# EAGLE schematic Power_Meter_v1.0 (EAGLE 9.1.0)
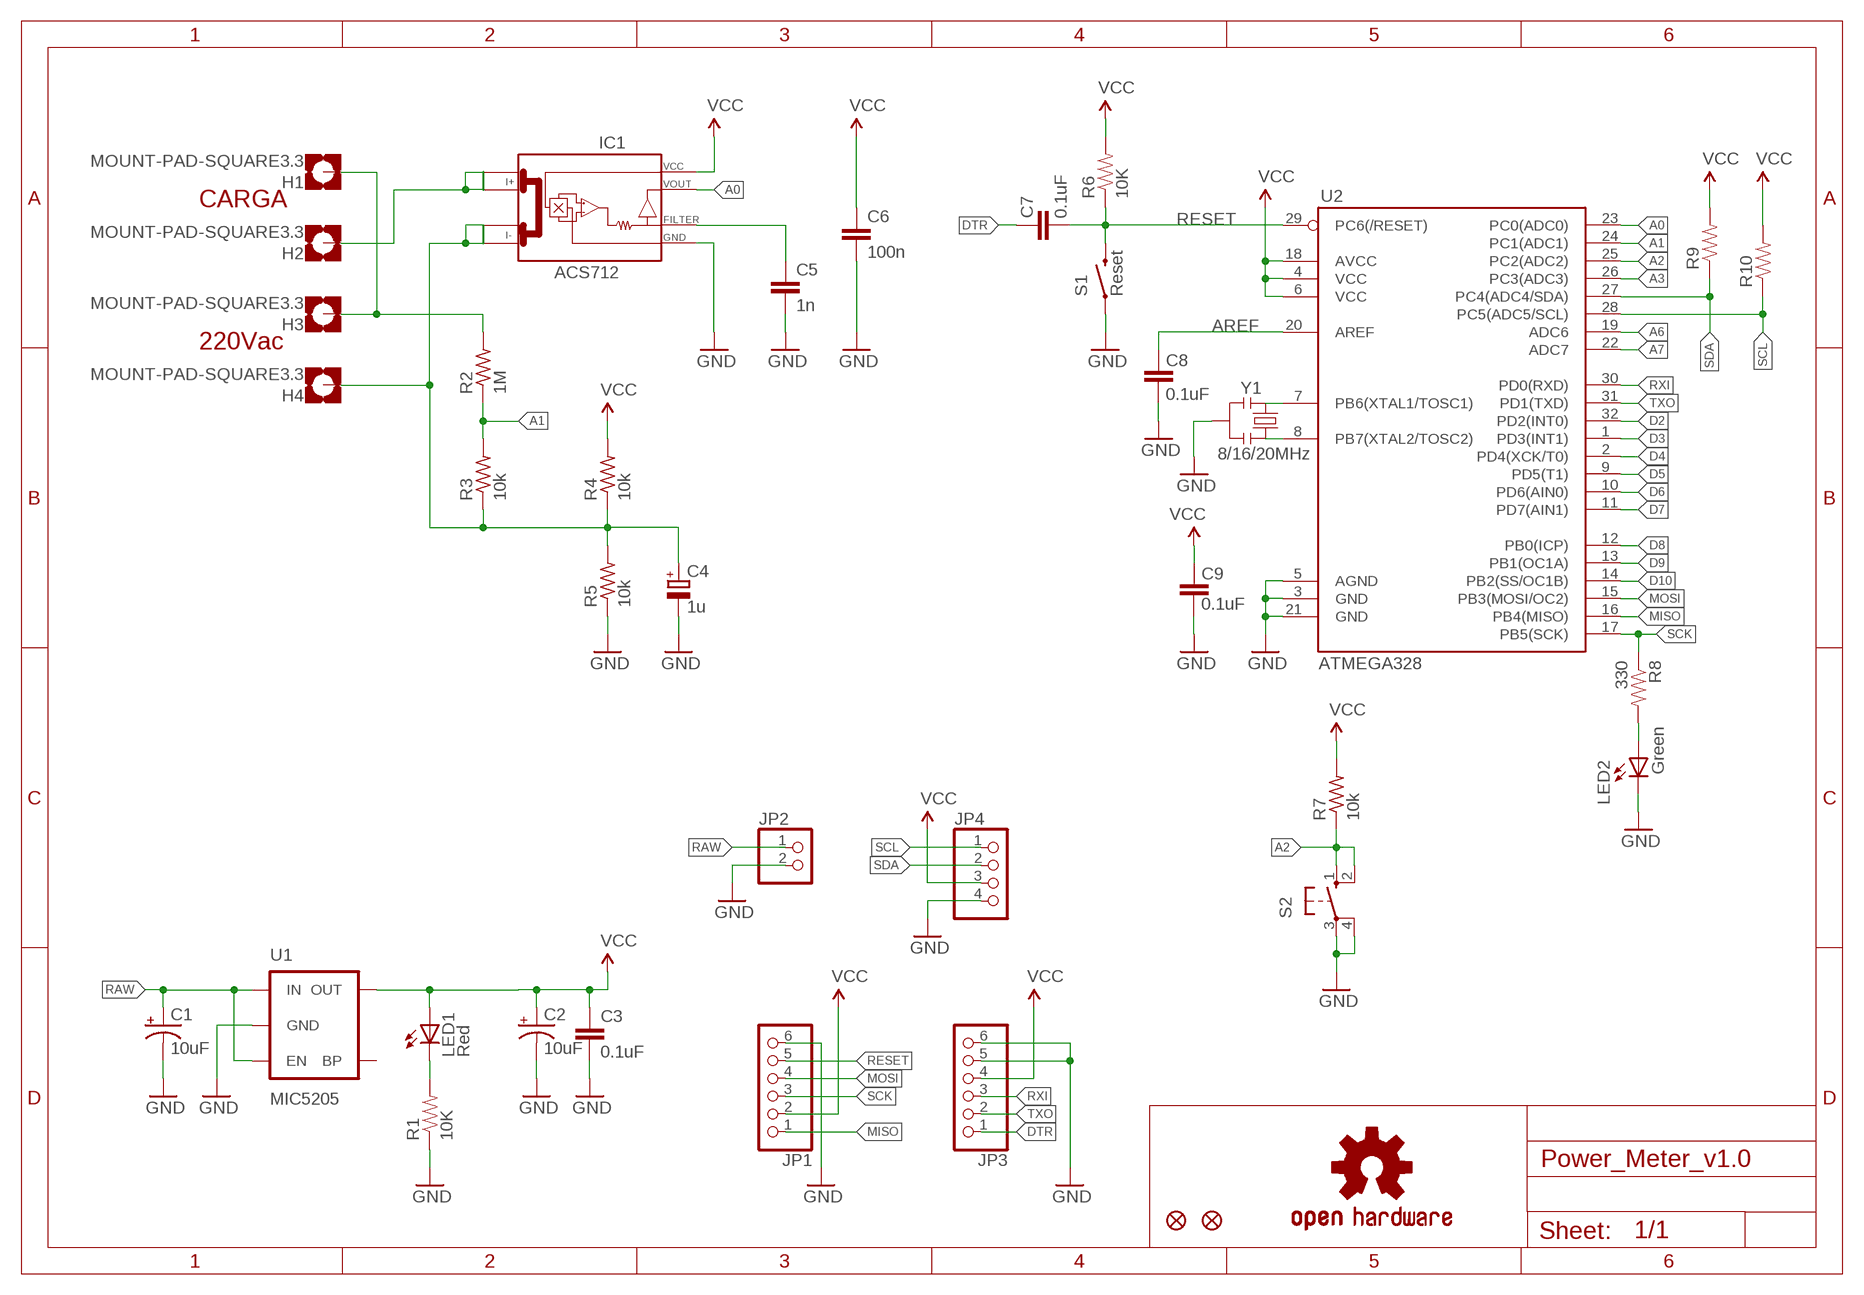
[diagram p0: schematic, sheet 1]

## Parts
C1  10uF  CAP_POL1206  [EIA3216]
C2  10uF  CAP_POL1206  [EIA3216]
C3  0.1uF  CAP0603-CAP  [0603-CAP]
C4  1u  CPOL-EUE2-5  [E2-5]
C5  1n  C-EUC0805K  [C0805K]
C6  100n  C-EUC0805K  [C0805K]
C7  0.1uF  CAP0603-CAP  [0603-CAP]
C8  0.1uF  CAP0603-CAP  [0603-CAP]
C9  0.1uF  CAP0603-CAP  [0603-CAP]
H1  MOUNT-PAD-SQUARE3.3  [3,3-PAD-SQUARE]
H2  MOUNT-PAD-SQUARE3.3  [3,3-PAD-SQUARE]
H3  MOUNT-PAD-SQUARE3.3  [3,3-PAD-SQUARE]
H4  MOUNT-PAD-SQUARE3.3  [3,3-PAD-SQUARE]
IC1  ACS712  [SO08]
JP1  PINHD-1X6  [1X06]
JP2  PINHD-1X2  [1X02]
JP3  PINHD-1X6  [1X06]
JP4  PINHD-1X4  [1X04]
JP5  FIDUCIAL1X2.5  [FIDUCIAL-1X2.5]
JP6  FIDUCIAL1X2.5  [FIDUCIAL-1X2.5]
LED1  Red  LED  [0603-LED-ALT1]
LED2  Green  LED  [0603-LED-ALT1]
R1  10K  RESISTOR0603-RES  [0603-RES]
R2  1M  R-US_0204/7  [0204/7]
R3  10k  R-US_0204/7  [0204/7]
R4  10k  R-US_0204/7  [0204/7]
R5  10k  R-US_0204/7  [0204/7]
R6  10K  RESISTOR0603-RES  [0603-RES]
R7  10k  R-US_0204/7  [0204/7]
R8  330  RESISTOR0603-RES  [0603-RES]
R9  RESISTOR0603-RES  [0603-RES]
R10  RESISTOR0603-RES  [0603-RES]
S1  Reset  SWITCH-MOMENTARY-2SMD-ALT01  [TACTILE-SWITCH-SMD-ALT01]
S2  10-XX  [B3F-10XX]
U1  MIC5205  V_REG_LDOSMD  [SOT23-5]
U2  ATMEGA328  ATMEGA168  [TQFP32-08]
U$5  OSHW-LOGOS  [OSHW-LOGO-S]
Y1  8/16/20MHz  RESONATOR1:1  [RESONATOR-SMD-1:1]

## Nets
A0: IC1.7(VOUT) U2.23(PC0(ADC0))
A1: R2.1 R3.2 U2.24(PC1(ADC1))
A2: R7.1 S2.1(S) S2.2(S1) U2.25(PC2(ADC2))
A3: U2.26(PC3(ADC3))
A6: U2.19(ADC6)
A7: U2.22(ADC7)
AREF: C8.2 U2.20(AREF)
D2: U2.32(PD2(INT0))
D3: U2.1(PD3(INT1))
D4: U2.2(PD4(XCK/T0))
D5: U2.9(PD5(T1))
D6: U2.10(PD6(AIN0))
D7: U2.11(PD7(AIN1))
D8: U2.12(PB0(ICP))
D9: U2.13(PB1(OC1A))
D10: U2.14(PB2(SS/OC1B))
DTR: C7.2 JP3.1
GND: C1.C(-) C2.C(-) C3.2 C4.- C5.2 C6.2 C8.1 C9.1 IC1.5(GND) JP1.6 JP2.2 JP3.5 JP3.6 JP4.4 LED2.C R1.1 R5.1 S1.1 S1.2 S2.3(P) S2.4(P1) U1.2(GND) U2.3(GND) U2.5(AGND) U2.21(GND) Y1.2
MISO: JP1.1 U2.16(PB4(MISO))
MOSI: JP1.4 U2.15(PB3(MOSI/OC2))
N$1: LED2.A R8.2
N$2: U2.8(PB7(XTAL2/TOSC2)) Y1.3
N$3: U2.7(PB6(XTAL1/TOSC1)) Y1.1
N$6: H1.B3,3(MOUNT) H3.B3,3(MOUNT) R2.2
N$7: C5.1 IC1.6(FILTER)
N$8: H2.B3,3(MOUNT) IC1.1(I+_0) IC1.2(I+_1)
N$9: LED1.C R1.2
N$10: C4.+ H4.B3,3(MOUNT) IC1.3(I-_0) IC1.4(I-_1) R3.1 R4.1 R5.2
RAW [vcc]: C1.A(+) JP2.1 U1.1(IN) U1.3(EN)
RESET: C7.1 JP1.5 R6.1 S1.3 S1.4 U2.29(PC6(/RESET))
RXI: JP3.3 U2.30(PD0(RXD))
SCK: JP1.3 R8.1 U2.17(PB5(SCK))
SCL: JP4.1 R10.1 U2.28(PC5(ADC5/SCL))
SDA: JP4.2 R9.1 U2.27(PC4(ADC4/SDA))
TXO: JP3.2 U2.31(PD1(TXD))
VCC: C2.A(+) C3.1 C6.1 C9.2 IC1.8(VCC) JP1.2 JP3.4 JP4.3 LED1.A R4.2 R6.2 R7.2 R9.2 R10.2 U1.5(OUT) U2.4(VCC) U2.6(VCC) U2.18(AVCC)
Unconnected: U1.4(BP)

## Notes on the sheet
- CARGA
- 220Vac

## Library data of the parts
C1 C2 = SparkFun:CAP_POL: Capacitor Polarized These are standard SMD and PTH capacitors. Normally 10uF, 47uF, and 100uF in electrolytic and tantalum varieties. Always verify the external diameter of the through hole cap, it varies with capacity, voltage, and manufacturer. The EIA devices should be standard.
C3 C7-C9 = SparkFun:CAP: Capacitor Standard 0603 ceramic capacitor, and 0.1" leaded capacitor.
C4 = rcl:CPOL-EU: POLARIZED CAPACITOR, European symbol; SPICEPREFIX: C
C5 C6 = rcl:C-EU: CAPACITOR, European symbol; SPICEPREFIX: C
H1-H4 = holes:MOUNT-PAD-SQUARE: MOUNTING PAD, square
IC1 = ACS712:ACS712
JP1 JP3 = pinhead:PINHD-1X6: PIN HEADER
JP2 = pinhead:PINHD-1X2: PIN HEADER
JP4 = pinhead:PINHD-1X4: PIN HEADER
JP5 JP6 = SparkFun:FIDUCIAL: Fiducial Alignment Points Various fiducial points for machine vision alignment.
LED1 LED2 = Testing:LED: LEDs Standard schematic elements and footprints for 5mm, 3mm, 1206, and 0603 sized LEDs. 5mm - Spark Fun Electronics SKU : COM-00529 (and others)
R1 R6 R8-R10 = SparkFun:RESISTOR: Resistor Basic schematic elements and footprints for 0603, 1206, and PTH resistors.
R2-R5 R7 = rcl:R-US_: RESISTOR, American symbol; SPICEPREFIX: R
S1 = Testing:SWITCH-MOMENTARY-2: Various NO switches- pushbuttons, reed, etc
S2 = switch-omron:10-XX: OMRON SWITCH; MPN: B3F-1000; OC_FARNELL: 176432; OC_NEWARK: 36M3542
U1 = SparkFun:V_REG_LDO: Voltage Regulator LDO Standard 150mA LDO voltage regulator in SOT-23 layout. Micrel part MIC5205. BP (by-pass) pin is used to lower output noise with 470pF cap.
U2 = SparkFun:ATMEGA168
U$5 = SparkFun-Aesthetics:OSHW-LOGO: Open Source Hardware Logo This logo indicates the piece of hardware it is found on incorporates a OSHW license and/or adheres to the definition of open source hardware found here: http://freedomdefined.org/OSHW
Y1 = Testing:RESONATOR: Resonator Small SMD resonator. This is the itty bitty 10/20MHz resonators with built in caps. CSTCE10M0G55 and CSTCE20M0V53. Footprint for SMD has been used in SFE production for years, and does work okay. 1:1 is an attempt to get larger fillets on the sides so it will be easier to inspect these solders in our AOI machine. The pads have been minimized to match the actual metal under the resonator. To see this relation, it includes an image import of the bottom side of the component. Imported to scale on layer 200.

## Net classes
0 default: width 0.203 mm
1 vcc: width 0.254 mm